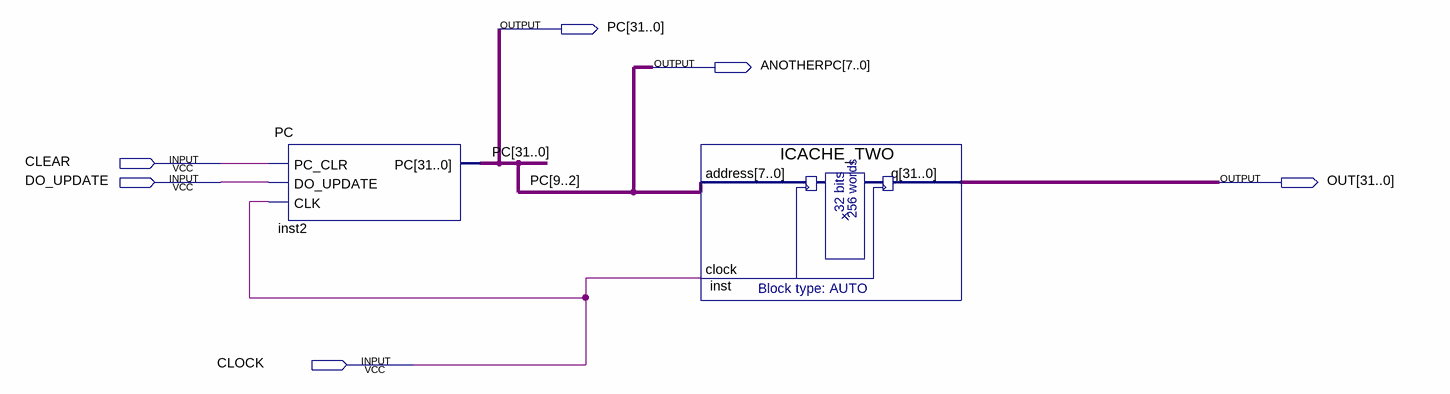
[diagram p0: schematic sheet]
// Quartus schematic MEM_TEST.bdf as structural Verilog: 2 symbols, 6 pins
module MEM_TEST (
  input  CLEAR,
  input  DO_UPDATE,
  input  CLOCK,
  output [31:0] PC,
  output [7:0] ANOTHERPC,
  output [31:0] OUT
);

  PC inst2 (.PC_CLR(CLEAR), .DO_UPDATE(DO_UPDATE), .CLK(CLOCK), .PC({PC[31:10], ANOTHERPC, PC[1:0]}));
  ICACHE_TWO inst (.address(ANOTHERPC), .clock(CLOCK), .q(OUT));

  assign PC[9:2] = ANOTHERPC;
endmodule
